# EAGLE schematic Enclosure 85x58 PMJR (EAGLE 9.6.2)
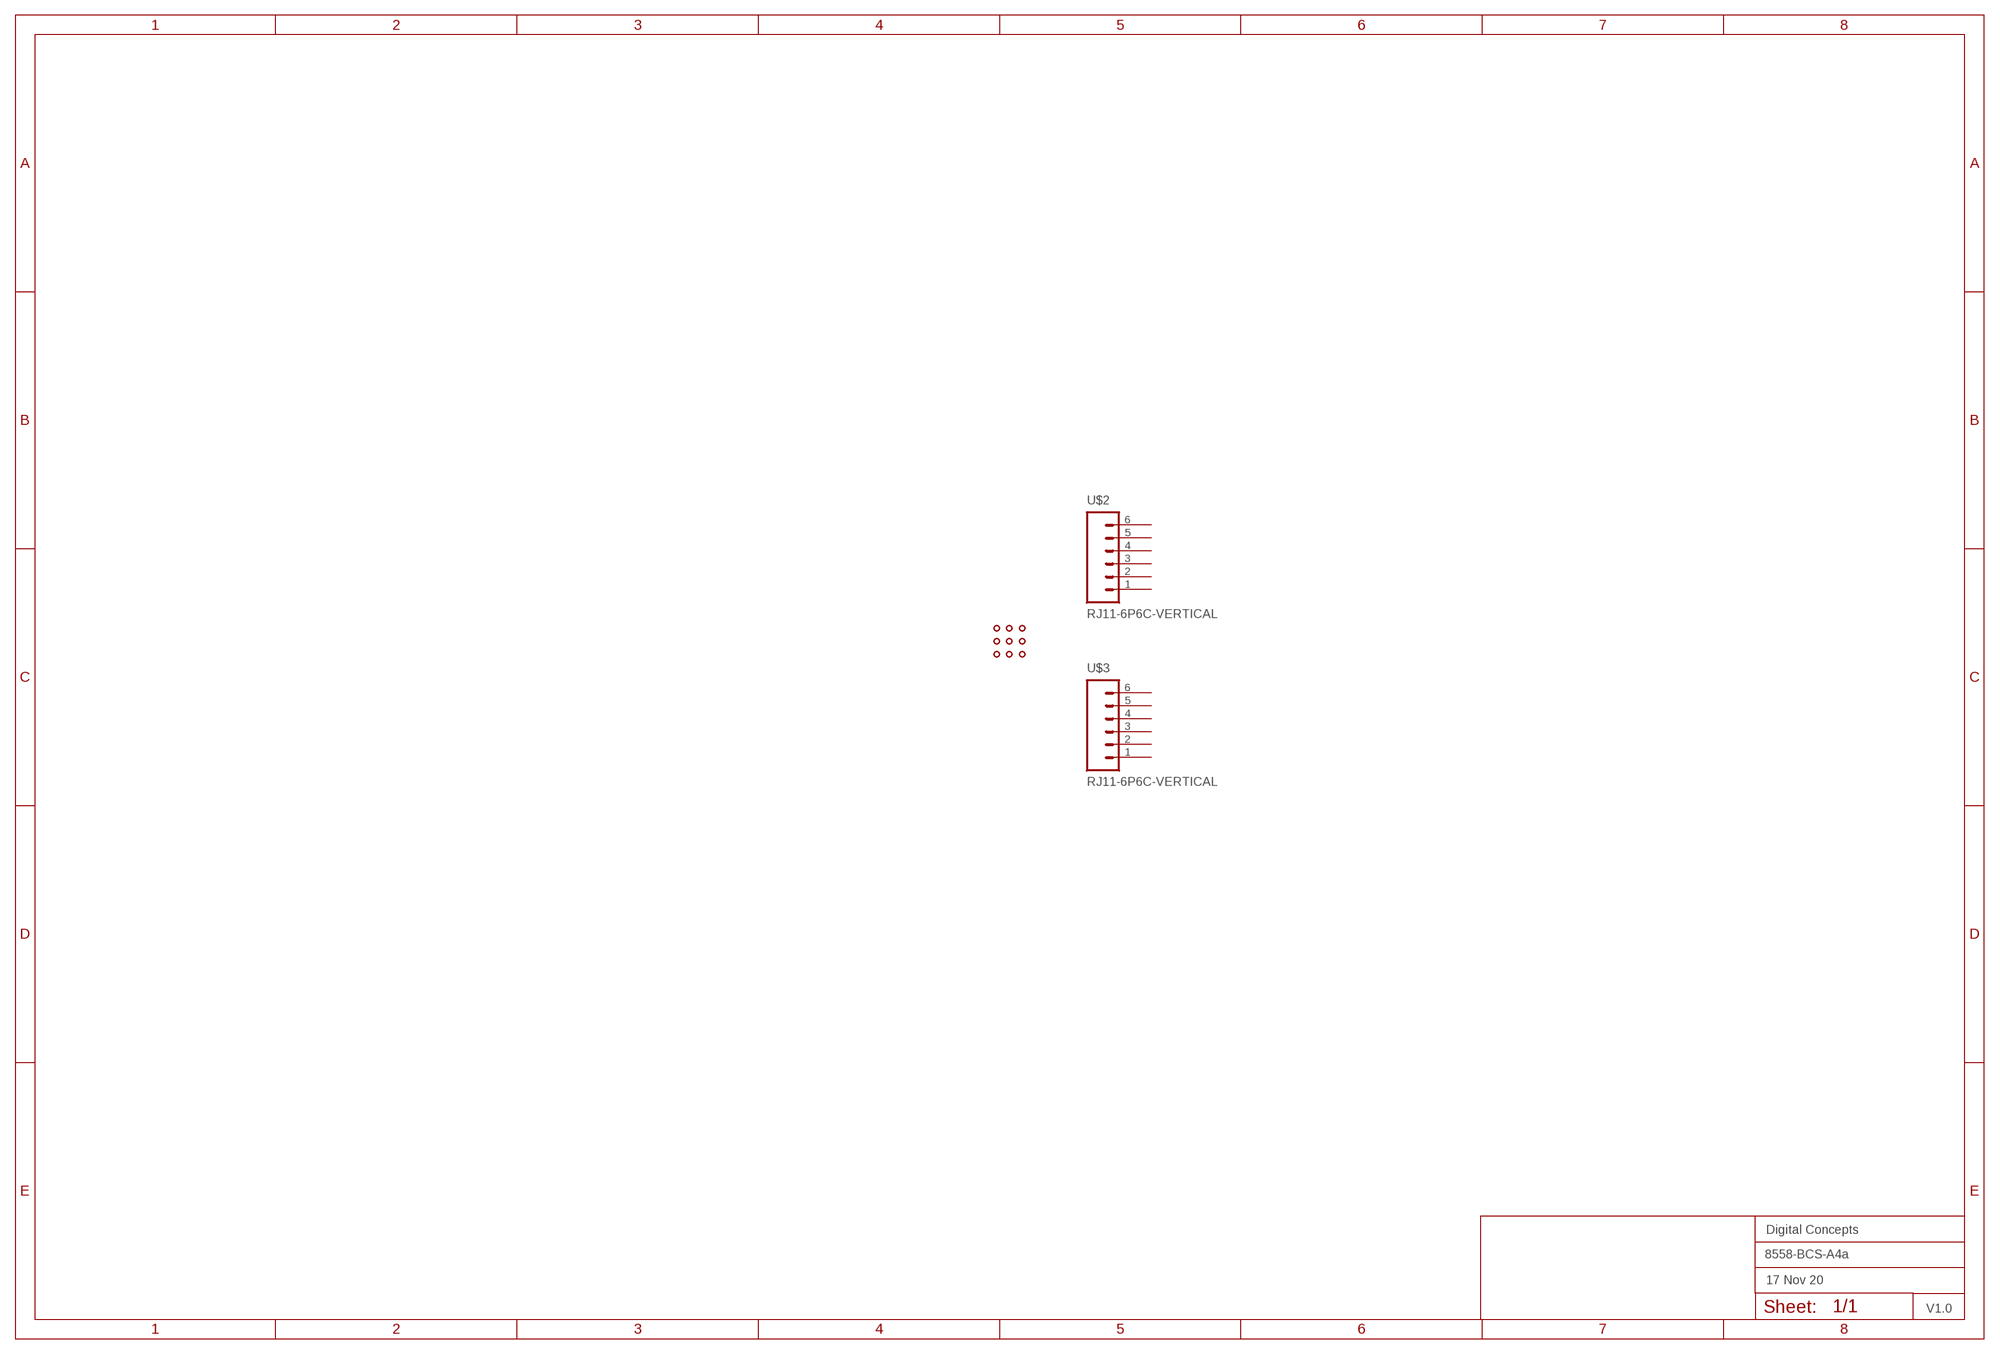
[diagram p0: schematic, sheet 1]
FRAME2 (A3L-LOC): DATE: 17 Nov 20; OWNER: Digital Concepts; TITLE: 8558-BCS-A4a; VERSION: V1.0

## Parts
U$1  PROTO-28X18-JST-RJ  [PROTO-28X18-JST-RJ]
U$2  RJ11-6P6C-VERTICAL  [RJ11-6-VERTICAL]
U$3  RJ11-6P6C-VERTICAL  [RJ11-6-VERTICAL]
Unconnected: U$2.1 U$2.2 U$2.3 U$2.4 U$2.5 U$2.6 U$3.1 U$3.2 U$3.3 U$3.4 U$3.5 U$3.6

## Library data of the parts
U$1 = digitalconcepts:PROTO-28X18-JST-RJ: 28 x 18 Prototyping board with JST pads and space for RJ11 sockets to fit an 85 x 58 enclosure
U$2 U$3 = digitalconcepts:RJ11-6P6C-VERTICAL: RJ11-6P6C-Vertical PCB Socket